# Altium project 电磁双车主控电路 第一版.PRJPCB
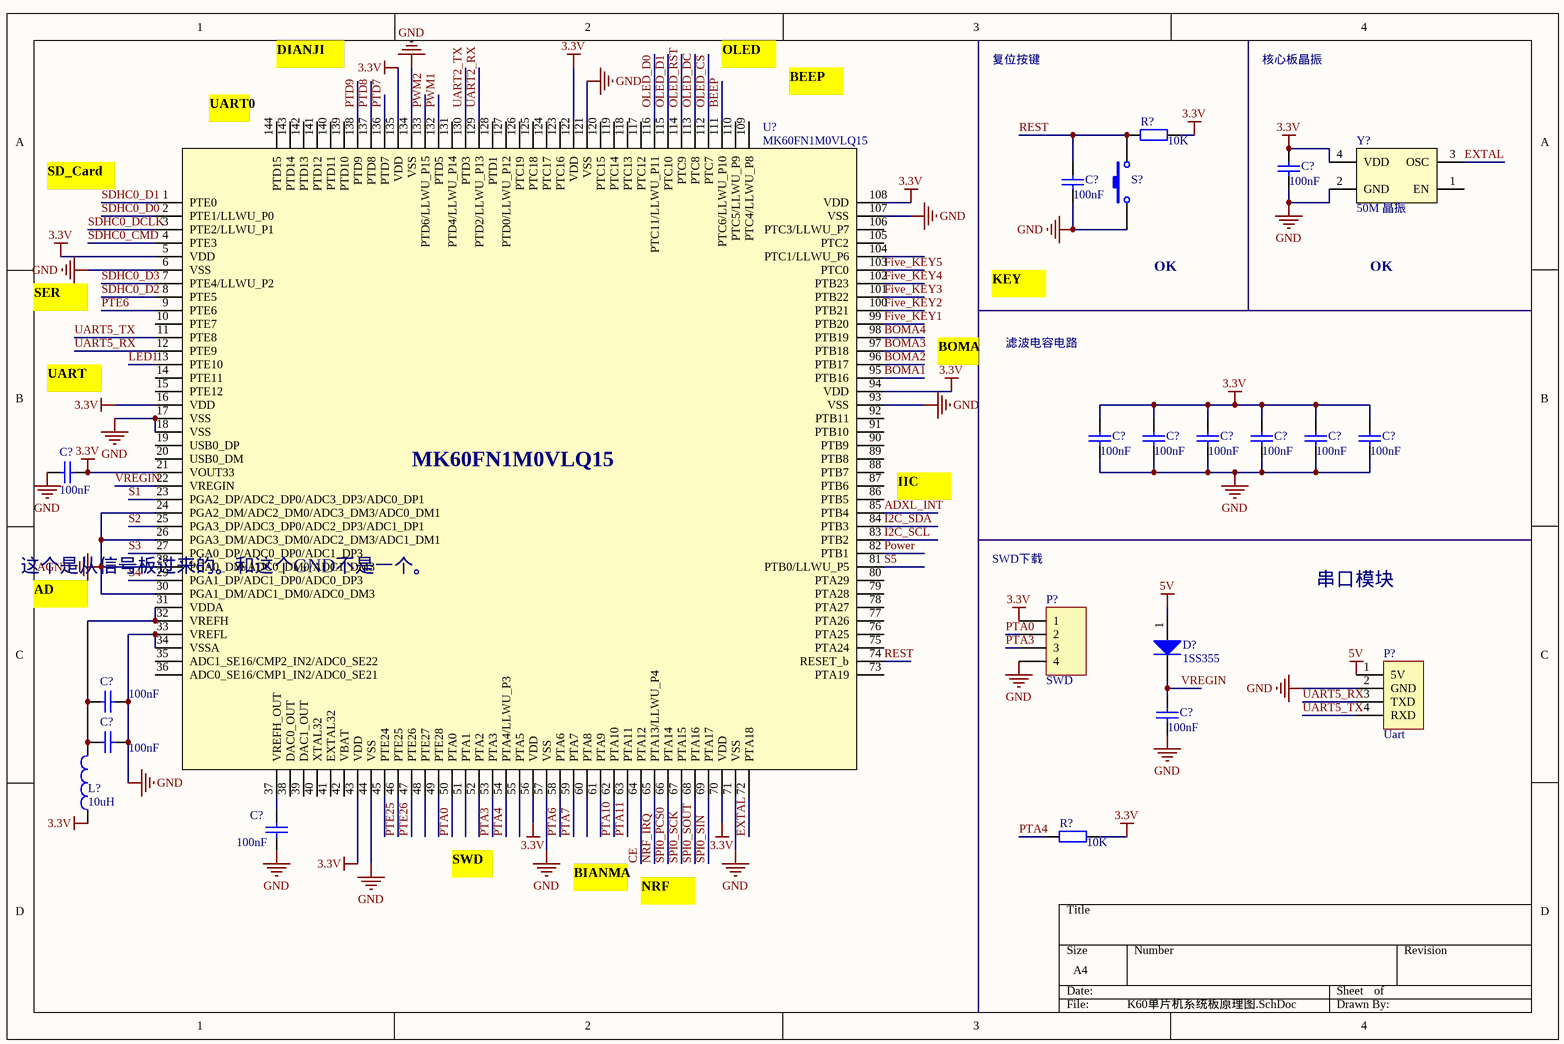
[diagram p0: K60单片机系统板原理图.SchDoc]
4 sheets, 112 parts. Net scope: global (net labels, ports and power ports of the same name join across sheets).
Board file: PCB1.PcbDoc
Sheets:
  K60单片机系统板原理图.SchDoc
  元器件模块原理图.SchDoc
  电机驱动原理图.SchDoc
  电源模块原理图.SchDoc

## Sheet K60单片机系统板原理图.SchDoc
size A4

### Parts
(Parts that share a designator on the sheet are numbered #1, #2 ... from top to bottom, then left to right.)
C?#1  value 100nF  [C0603]  (hidden comment: Cap)
C?#2  value 100nF  [C0603]  (hidden comment: Cap)
C?#3  value 100nF  [C0603]  (hidden comment: Cap)
C?#4  value 100nF  [C0603]  (hidden comment: Cap)
C?#5  value 100nF  [C0603]  (hidden comment: Cap)
C?#6  value 100nF  [C0603]  (hidden comment: Cap)
C?#7  value 100nF  [C0603]  (hidden comment: Cap)
C?#8  value 100nF  [C0603]  (hidden comment: Cap)
C?#9  value 100nF  [C0603]  (hidden comment: Cap)
C?#10  value 100nF  [C0603]  (hidden comment: Cap)
C?#11  value 100nF  [C0603]  (hidden comment: Cap)
C?#12  value 100nF  [C0603]  (hidden comment: Cap)
C?#13  value 100nF  [C0603]  (hidden comment: Cap)
D?#1  1SS355  [二极管贴片]
L?#1  value 10uH  [R0603]  (hidden comment: Inductor)
P?#1  SWD  [HDR1X4]
P?#2  Uart  [HDR1X4]
R?#1  value 10K  [R0603]  (hidden comment: Res2)
R?#2  value 10K  [R0603]  (hidden comment: Res2)
S?#1  SW-PB  [KEY]  (value not drawn)
U?#1  MK60FN1M0VLQ15  [K60_QFP144]
Y?  50M 晶振  [50MHz_MiNi]

### Nets
3.3V: C?#1.1 C?#3.1 C?#4.1 C?#5.1 C?#6.1 C?#7.1 C?#8.1 C?#9.2 L?#1.1 P?#1.1 R?#1.2 R?#2.2 U?#1.5(VDD) U?#1.16(VDD) U?#1.21(VOUT33) U?#1.43(VDD) U?#1.56(VDD) U?#1.70(VDD) U?#1.94(VDD) U?#1.108(VDD) U?#1.122(VDD) U?#1.135(VDD) Y?.4(VDD)
5V: D?#1.1(A) P?#2.1(5V)
AGND: U?#1.24(PGA2_DM/ADC2_DM0/ADC3_DM3/ADC0_DM1) U?#1.26(PGA3_DM/ADC3_DM0/ADC2_DM3/ADC1_DM1) U?#1.28(PGA0_DM/ADC0_DM0/ADC1_DM3) U?#1.30(PGA1_DM/ADC1_DM0/ADC0_DM3)
GND: C?#1.2 C?#2.2 C?#3.2 C?#4.2 C?#5.2 C?#6.2 C?#7.2 C?#8.2 C?#9.1 C?#10.2 C?#11.1 C?#12.2 C?#13.2 P?#1.4 P?#2.2(GND) S?#1.1 U?#1.6(VSS) U?#1.17(VSS) U?#1.18(VSS) U?#1.33(VREFL) U?#1.34(VSSA) U?#1.44(VSS) U?#1.57(VSS) U?#1.71(VSS) U?#1.93(VSS) U?#1.107(VSS) U?#1.121(VSS) U?#1.134(VSS) Y?.2(GND)
ADXL_INT: U?#1.85(PTB4)
BEEP: U?#1.111(PTC6/LLWU_P10)
BOMA1: U?#1.95(PTB16)
BOMA2: U?#1.96(PTB17)
BOMA3: U?#1.97(PTB18)
BOMA4: U?#1.98(PTB19)
CE: U?#1.64(PTA12)
EXTAL: U?#1.72(PTA18) Y?.3(OSC)
Five_KEY1: U?#1.99(PTB20)
Five_KEY2: U?#1.100(PTB21)
Five_KEY3: U?#1.101(PTB22)
Five_KEY4: U?#1.102(PTB23)
Five_KEY5: U?#1.103(PTC0)
I2C_SCL: U?#1.83(PTB2)
I2C_SDA: U?#1.84(PTB3)
LED1: U?#1.13(PTE10)
NRF_IRQ: U?#1.65(PTA13/LLWU_P4)
OLED_CS: U?#1.112(PTC7)
OLED_D0: U?#1.116(PTC11/LLWU_P11)
OLED_D1: U?#1.115(PTC10)
OLED_DC: U?#1.113(PTC8)
OLED_RST: U?#1.114(PTC9)
Power: U?#1.82(PTB1)
PTA0: P?#1.2 U?#1.50(PTA0)
PTA3: P?#1.3 U?#1.53(PTA3)
PTA4: R?#2.1 U?#1.54(PTA4/LLWU_P3)
PTA6: U?#1.58(PTA6)
PTA7: U?#1.59(PTA7)
PTA10: U?#1.62(PTA10)
PTA11: U?#1.63(PTA11)
PTD7: U?#1.136(PTD7)
PTD8: U?#1.137(PTD8)
PTD9: U?#1.138(PTD9)
PTE6: U?#1.9(PTE6)
PTE25: U?#1.46(PTE25)
PTE26: U?#1.47(PTE26)
PWM1: U?#1.132(PTD5)
PWM2: U?#1.133(PTD6/LLWU_P15)
REST: C?#2.1 R?#1.1 S?#1.2 U?#1.74(RESET_b)
S1: U?#1.23(PGA2_DP/ADC2_DP0/ADC3_DP3/ADC0_DP1)
S2: U?#1.25(PGA3_DP/ADC3_DP0/ADC2_DP3/ADC1_DP1)
S3: U?#1.27(PGA0_DP/ADC0_DP0/ADC1_DP3)
S4: U?#1.29(PGA1_DP/ADC1_DP0/ADC0_DP3)
S5: U?#1.81(PTB0/LLWU_P5)
SDHC0_CMD: U?#1.4(PTE3)
SDHC0_D0: U?#1.2(PTE1/LLWU_P0)
SDHC0_D1: U?#1.1(PTE0)
SDHC0_D2: U?#1.8(PTE5)
SDHC0_D3: U?#1.7(PTE4/LLWU_P2)
SDHC0_DCLK: U?#1.3(PTE2/LLWU_P1)
SPI0_PCS0: U?#1.66(PTA14)
SPI0_SCK: U?#1.67(PTA15)
SPI0_SIN: U?#1.69(PTA17)
SPI0_SOUT: U?#1.68(PTA16)
UART2_RX: U?#1.129(PTD2/LLWU_P13)
UART2_TX: U?#1.130(PTD3)
UART5_RX: P?#2.3(TXD) U?#1.12(PTE9)
UART5_TX: P?#2.4(RXD) U?#1.11(PTE8)
VREGIN: C?#11.2 D?#1.2(K) U?#1.22(VREGIN)
NetC?#10_1: C?#10.1 C?#12.1 L?#1.2 U?#1.31(VDDA) U?#1.32(VREFH)
NetC?#13_1: C?#13.1 U?#1.37(VREFH_OUT)

Not connected (* = marked no-connect by the designer): U?#1 10(PTE7) 14(PTE11) 15(PTE12) 19(USB0_DP) 20(USB0_DM) 35(ADC1_SE16/CMP2_IN2/ADC0_SE22) 36(ADC0_SE16/CMP1_IN2/ADC0_SE21) 38(DAC0_OUT) 39(DAC1_OUT) 40(XTAL32) 41(EXTAL32) 42(VBAT) 45(PTE24) 48(PTE27) 49(PTE28) 51(PTA1) 52(PTA2) 55(PTA5) 60(PTA8) 61(PTA9) 73(PTA19) 75(PTA24) 76(PTA25) 77(PTA26) 78(PTA27) 79(PTA28) 80(PTA29) 86(PTB5) 87(PTB6) 88(PTB7) 89(PTB8) 90(PTB9) 91(PTB10) 92(PTB11) 104(PTC1/LLWU_P6) 105(PTC2) 106(PTC3/LLWU_P7) 109(PTC4/LLWU_P8) 110(PTC5/LLWU_P9) 117(PTC12) 118(PTC13) 119(PTC14) 120(PTC15) 123(PTC16) 124(PTC17) 125(PTC18) 126(PTC19) 127(PTD0/LLWU_P12) 128(PTD1) 131(PTD4/LLWU_P14) 139(PTD10) 140(PTD11) 141(PTD12) 142(PTD13) 143(PTD14) 144(PTD15); Y? 1(EN)

### Notes on the sheet
- (near U?#1) UART0
- DIANJI
- OLED
- BEEP
- 复位按键
- 核心板晶振
- SD_Card
- OK
- SER
- KEY
- UART
- BOMA
- 滤波电容电路
- (near U?#1) IIC
- (near U?#1) 这个是从信号板过来的。和这个GND不是一个。
- SWD下载
- 串口模块
- AD
- SWD
- BIANMA
- NRF

### Library data of the parts
C?#1-C?#13 = Cap: Capacitor; Published: 8-Jun-2000; LatestRevisionDate: 17-Jul-2002; LatestRevisionNote: Re-released for DXP Platform.; PackageReference: RAD-0.3; Publisher: Altium Limited
  C?#11: PackageDescription: Radial Cap, Thru-Hole; 2 Leads; 0.3 in Pin Spacing
D?#1 = Diode 1N4002: 1 Amp General Purpose Rectifier; Published: 8-Jun-2000; LatestRevisionDate: 17-Jul-2002; LatestRevisionNote: Re-released for DXP Platform.; DatasheetVersion: 1998; PackageVersion: Aug-1999; PackageReference: DO-41; Publisher: Altium Limited; PackageDescription: Diode, Axial; Body 5.2 x 2.7 mm (LxDia. max), Lead Dia. 0.86 mm (max); Code_JEDEC: DO-204-AL; ComponentLink1Description: Manufacturer Link; ComponentLink1URL: http://www.fairchildsemi.com/; ComponentLink2Description: Datasheet; ComponentLink2URL: http://www.fairchildsemi.com/ds/1N%2F1N4001.pdf
L?#1 = Inductor: Code_IEC: 1005; Published: 8-Jun-2000; LatestRevisionDate: 17-Jul-2002; LatestRevisionNote: Re-released for DXP Platform.; PackageReference: 0402-A; Publisher: Altium Limited; Code_JEITA: 0402
P?#1 P?#2 = Header 4: Header, 4-Pin; LatestRevisionDate: 17-Jul-2002; LatestRevisionNote: Re-released for DXP Platform.; Publisher: Altium Limited
R?#1 R?#2 = Res2: Resistor; Published: 8-Jun-2000; LatestRevisionDate: 17-Jul-2002; LatestRevisionNote: Re-released for DXP Platform.; PackageReference: AXIAL-0.4; Publisher: Altium Limited
S?#1 = SW-PB: Switch; Published: 24-Mar-1999; LatestRevisionDate: 17-Jul-2002; LatestRevisionNote: Re-released for DXP Platform.; PackageReference: SPST-2; Publisher: Altium Limited

## Sheet 元器件模块原理图.SchDoc
size A4
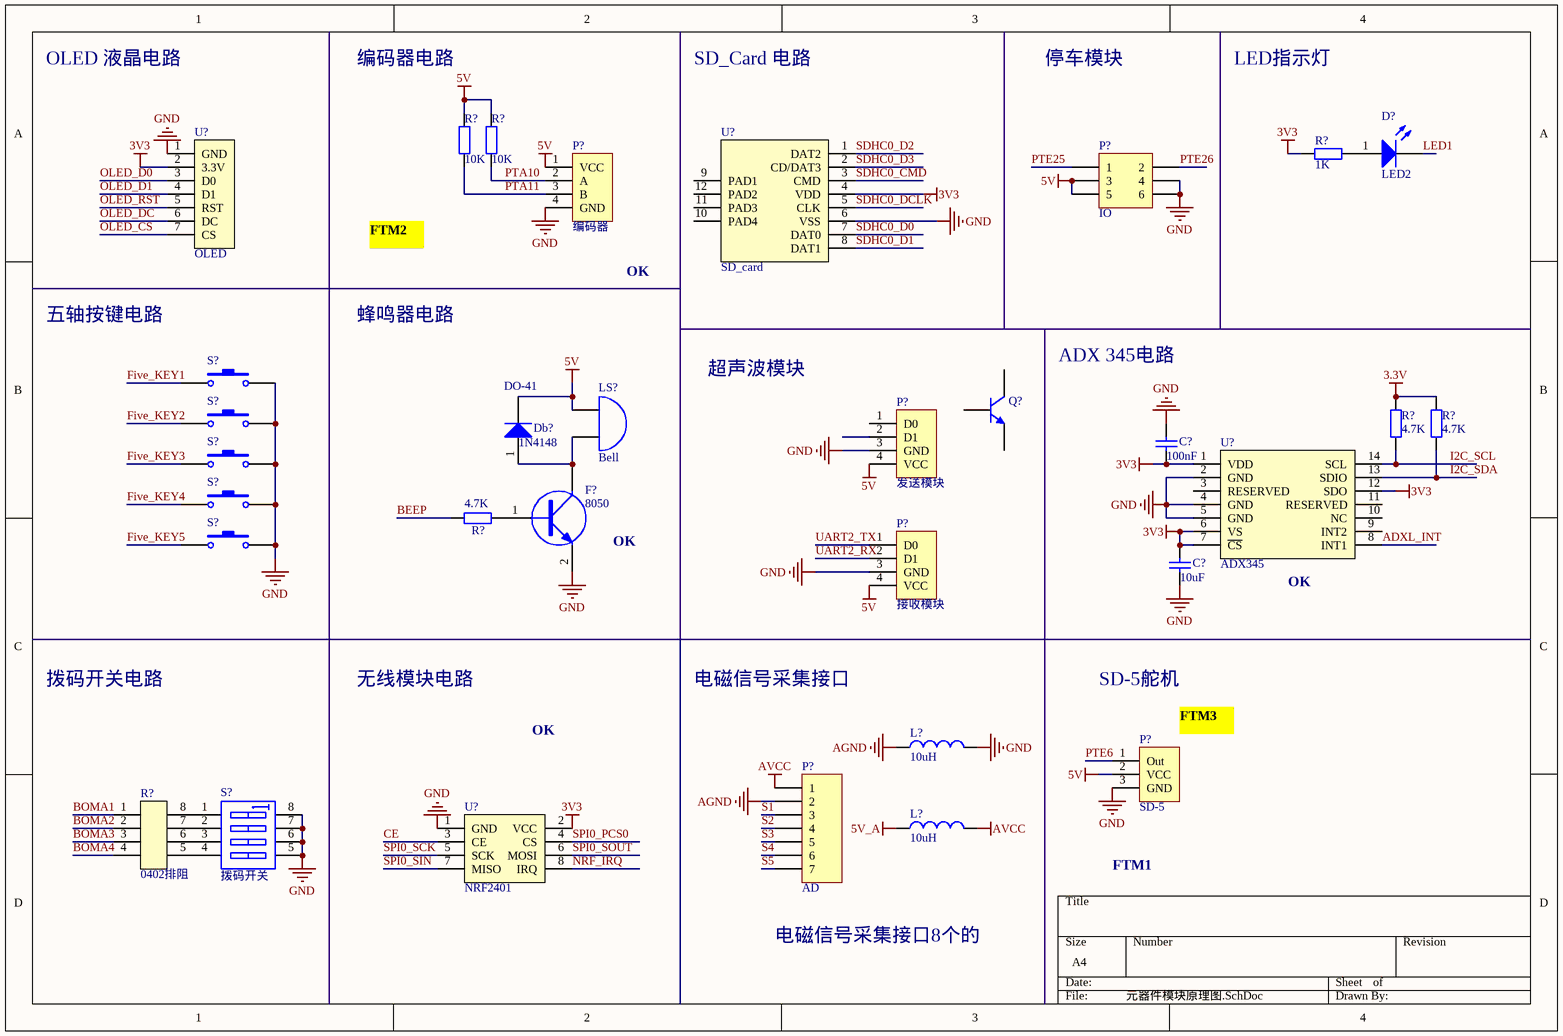
[diagram p1: 元器件模块原理图.SchDoc]

### Parts
(Parts that share a designator on the sheet are numbered #1, #2 ... from top to bottom, then left to right.)
C?#14  value 100nF  [C0603]  (hidden comment: Cap)
C?#15  value 10uF  [C0603]  (hidden comment: Cap)
D?#2  LED2  [LED-0805 - duplicate]
Db?  1N4148  PackageReference: DO-41  [二极管贴片]
F?#1  8050  [8050 贴片三极管]
L?#2  value 10uH  [R0603]  (hidden comment: Inductor)
L?#3  value 10uH  [R0603]  (hidden comment: Inductor)
LS?  Bell  [蜂鸣器]
P?#3  编码器  [HDR1X4]
P?#4  IO  [HDR2X3]
P?#5  发送模块  [HDR1X4]
P?#6  接收模块  [HDR1X4]
P?#7  SD-5  [HDR1X3]
P?#8  AD  [HDR1X7]
Q?#1  2N3904  [TO-92A]  (value not drawn)
R?#3  value 10K  [R0603]  (hidden comment: Res2)
R?#4  value 10K  [R0603]  (hidden comment: Res2)
R?#5  value 1K  [R0603]  (hidden comment: Res2)
R?#6  4.7K  [R0603]
R?#7  4.7K  [R0603]
R?#8  4.7K  [R0603]
R?#9  0402排阻  [0402_2]
S?#2  SW-PB  [KEY]  (value not drawn)
S?#3  SW-PB  [KEY]  (value not drawn)
S?#4  SW-PB  [KEY]  (value not drawn)
S?#5  SW-PB  [KEY]  (value not drawn)
S?#6  SW-PB  [KEY]  (value not drawn)
S?#7  拨码开关  [拨码开关]
U?#2  OLED  [HDR1X7]
U?#3  SD_card  [SD_Card]
U?#4  ADX345
U?#5  NRF2401  [HDR2X4]

### Nets
3.3V: R?#6.2 R?#7.2
3V3: C?#14.2 C?#15.1 R?#5.2 U?#2.2(3.3V) U?#3.4(VDD) U?#4.1(VDD) U?#4.6(VS) U?#4.7(~{CS}) U?#4.12(SDO) U?#5.2(VCC)
5V: Db?.2(K) LS?.1(A) P?#3.1(VCC) P?#4.3 P?#4.5 P?#5.4(VCC) P?#6.4(VCC) P?#7.2(VCC) R?#3.2 R?#4.2
5V_A: L?#3.1
AGND: L?#2.1 P?#8.2
AVCC: L?#3.2 P?#8.1
GND: C?#14.1 C?#15.2 F?#1.2(E) L?#2.2 P?#3.4(GND) P?#4.4 P?#4.6 P?#5.3(GND) P?#6.3(GND) P?#7.3(GND) S?#2.2 S?#3.2 S?#4.2 S?#5.2 S?#6.2 S?#7.5(B4) S?#7.6(B3) S?#7.7(B2) S?#7.8(B1) U?#2.1(GND) U?#3.6(VSS) U?#4.2(GND) U?#4.4(GND) U?#4.5(GND) U?#5.1(GND)
ADXL_INT: U?#4.8(INT1)
BEEP: R?#8.1
BOMA1: R?#9.1
BOMA2: R?#9.2
BOMA3: R?#9.3
BOMA4: R?#9.4
CE: U?#5.3(CE)
Five_KEY1: S?#2.1
Five_KEY2: S?#3.1
Five_KEY3: S?#4.1
Five_KEY4: S?#5.1
Five_KEY5: S?#6.1
I2C_SCL: R?#6.1 U?#4.14(SCL)
I2C_SDA: R?#7.1 U?#4.13(SDIO)
LED1: D?#2.2(K)
NRF_IRQ: U?#5.8(IRQ)
OLED_CS: U?#2.7(CS)
OLED_D0: U?#2.3(D0)
OLED_D1: U?#2.4(D1)
OLED_DC: U?#2.6(DC)
OLED_RST: U?#2.5(RST)
PTA10: P?#3.2(A) R?#4.1
PTA11: P?#3.3(B) R?#3.1
PTE6: P?#7.1(Out)
PTE25: P?#4.1
PTE26: P?#4.2
S1: P?#8.3
S2: P?#8.4
S3: P?#8.5
S4: P?#8.6
S5: P?#8.7
SDHC0_CMD: U?#3.3(CMD)
SDHC0_D0: U?#3.7(DAT0)
SDHC0_D1: U?#3.8(DAT1)
SDHC0_D2: U?#3.1(DAT2)
SDHC0_D3: U?#3.2(CD/DAT3)
SDHC0_DCLK: U?#3.5(CLK)
SPI0_PCS0: U?#5.4(CS)
SPI0_SCK: U?#5.5(SCK)
SPI0_SIN: U?#5.7(MISO)
SPI0_SOUT: U?#5.6(MOSI)
UART2_RX: P?#6.2(D1)
UART2_TX: P?#6.1(D0)
NetD?#2_1: D?#2.1(A) R?#5.1
NetDb?_1: Db?.1(A) F?#1.3(C) LS?.2(B)
NetF?#1_1: F?#1.1(B) R?#8.2
NetR?#9_5: R?#9.5 S?#7.4(A4)
NetR?#9_6: R?#9.6 S?#7.3(A3)
NetR?#9_7: R?#9.7 S?#7.2(A2)
NetR?#9_8: R?#9.8 S?#7.1(A1)

Not connected (* = marked no-connect by the designer): P?#5 1(D0) 2(D1); Q?#1 1(E) 2(B) 3(C); U?#3 9(PAD1) 10(PAD4) 11(PAD3) 12(PAD2); U?#4 3(RESERVED) 9(INT2) 10(NC) 11(RESERVED)

### Notes on the sheet
- OLED 液晶电路
- 编码器电路
- SD_Card 电路
- 停车模块
- LED指示灯
- FTM2
- 五轴按键电路
- 蜂鸣器电路
- OK
- 超声波模块
- ADX 345电路
- (near F?#1) OK
- (near U?#4) OK
- 拨码开关电路
- 无线模块电路
- 电磁信号采集接口
- SD-5舵机
- (near P?#7) FTM3
- FTM1
- 电磁信号采集接口8个的

### Library data of the parts
C?#14 C?#15 = Cap: Capacitor; Published: 8-Jun-2000; LatestRevisionDate: 17-Jul-2002; LatestRevisionNote: Re-released for DXP Platform.; PackageReference: RAD-0.3; Publisher: Altium Limited
D?#2 = LED2: Typical RED, GREEN, YELLOW, AMBER GaAs LED; Published: 8-Jun-2000; LatestRevisionDate: 17-Jul-2002; LatestRevisionNote: Re-released for DXP Platform.; PackageDocument: Feb-2002; PackageReference: 3.2X1.6X1.1; Publisher: Altium Limited
Db? = Diode 1N4001: 1 Amp General Purpose Rectifier; Published: 8-Jun-2000; LatestRevisionDate: 17-Jul-2002; LatestRevisionNote: Re-released for DXP Platform.; DatasheetVersion: 1998; PackageVersion: Aug-1999; Publisher: Altium Limited; PackageDescription: Diode, Axial; Body 5.2 x 2.7 mm (LxDia. max), Lead Dia. 0.86 mm (max); Code_JEDEC: DO-204-AL; ComponentLink1Description: Manufacturer Link; ComponentLink1URL: http://www.fairchildsemi.com/; ComponentLink2Description: Datasheet; ComponentLink2URL: http://www.fairchildsemi.com/ds/1N%2F1N4001.pdf
F?#1 = NPN: NPN Transistor
L?#2 L?#3 = Inductor: Code_IEC: 1005; Published: 8-Jun-2000; LatestRevisionDate: 17-Jul-2002; LatestRevisionNote: Re-released for DXP Platform.; PackageReference: 0402-A; Publisher: Altium Limited; Code_JEITA: 0402
LS? = Bell: Electrical Bell; Published: 24-Mar-1999; LatestRevisionDate: 17-Jul-2002; LatestRevisionNote: Re-released for DXP Platform.; PackageReference: PIN2; Publisher: Altium Limited
P?#3 P?#5 P?#6 = Header 4: Header, 4-Pin; LatestRevisionDate: 17-Jul-2002; LatestRevisionNote: Re-released for DXP Platform.; Publisher: Altium Limited
P?#4 = Header 3X2: Header, 3-Pin, Dual row; LatestRevisionDate: 17-Jul-2002; LatestRevisionNote: Re-released for DXP Platform.; Publisher: Altium Limited
P?#7 = Header 3: Header, 3-Pin; LatestRevisionDate: 17-Jul-2002; LatestRevisionNote: Re-released for DXP Platform.; Publisher: Altium Limited
P?#8 = Header 7: Header, 7-Pin; LatestRevisionDate: 17-Jul-2002; LatestRevisionNote: Re-released for DXP Platform.; Publisher: Altium Limited
Q?#1 = 2N3904: NPN General Purpose Amplifier; Published: 8-Jun-2000; LatestRevisionDate: 15-Jan-2003; LatestRevisionNote: PCB Footprint 'BCY-W3/D4.7' replaced; DatasheetVersion: 1997; PackageVersion: Sep-1998; PackageReference: TO-92A; Publisher: Altium Limited; PackageDescription: TO, Flat Index; 3 In-Line, Axial Leads; Body Dia. 4.5mm; Leads 0.51 x 0.48 mm (max); ComponentLink1Description: Manufacturer Link; ComponentLink1URL: http://www.fairchildsemi.com/; ComponentLink2Description: Datasheet; ComponentLink2URL: http://www.fairchildsemi.com/ds/2N%2F2N3904.pdf
R?#3-R?#8 = Res2: Resistor; Published: 8-Jun-2000; LatestRevisionDate: 17-Jul-2002; LatestRevisionNote: Re-released for DXP Platform.; PackageReference: AXIAL-0.4; Publisher: Altium Limited
  R?#6-R?#8: PackageDescription: Axial Device, Thru-Hole; 2 Leads; 0.4 in Pin Spacing; Value: 4.7K
S?#2-S?#6 = SW-PB: Switch; Published: 24-Mar-1999; LatestRevisionDate: 17-Jul-2002; LatestRevisionNote: Re-released for DXP Platform.; PackageReference: SPST-2; Publisher: Altium Limited
S?#7 = SW DIP-4: DIP Switch, 4 Position, SPST; Published: 24-Mar-1999; LatestRevisionDate: 17-Jul-2002; LatestRevisionNote: Re-released for DXP Platform.; PackageReference: SO8; Publisher: Altium Limited; Code_JEDEC: MS-012-AA; Code_IPC: SO8

## Sheet 电机驱动原理图.SchDoc
size A4
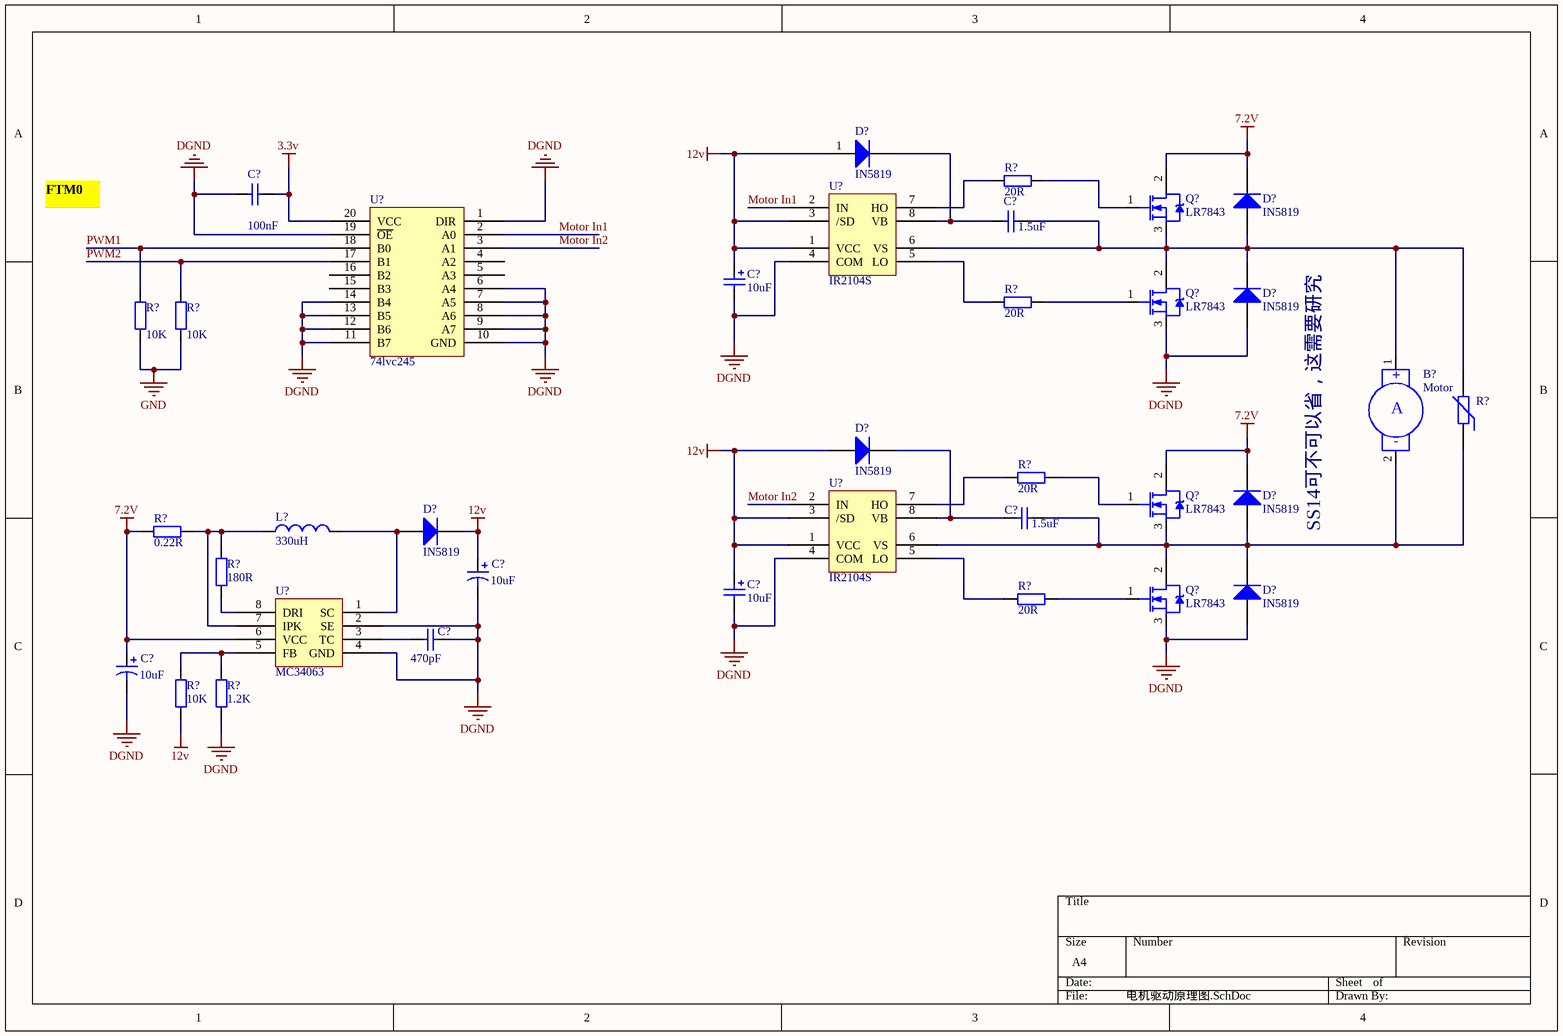
[diagram p2: 电机驱动原理图.SchDoc]

### Parts
(Parts that share a designator on the sheet are numbered #1, #2 ... from top to bottom, then left to right.)
B?  Motor  [7.2V]
C?#16  value 100nF  [C0603]  (hidden comment: Cap)
C?#17  value 1.5uF  [C0603]  (hidden comment: Cap Semi)
C?#18  value 10uF  [C0603]  (hidden comment: Cap Pol1)
C?#19  value 1.5uF  [C0603]  (hidden comment: Cap Semi)
C?#20  value 10uF  [钽电容]  (hidden comment: Cap Pol1)
C?#21  value 10uF  [C0603]  (hidden comment: Cap Pol1)
C?#22  value 470pF  [C0603]  (hidden comment: Cap Semi)
C?#23  value 10uF  [钽电容]  (hidden comment: Cap Pol1)
D?#3  IN5819  [二极管贴片]
D?#4  IN5819  [二极管贴片]
D?#5  IN5819  [二极管贴片]
D?#6  IN5819  [二极管贴片]
D?#7  IN5819  [二极管贴片]
D?#8  IN5819  [二极管贴片]
D?#9  IN5819  [二极管贴片]
L?#4  value 330uH  [221贴片电感]  (hidden comment: Inductor)
Q?#2  LR7843  [LR7843]
Q?#3  LR7843  [LR7843]
Q?#4  LR7843  [LR7843]
Q?#5  LR7843  [LR7843]
R?#10  value 20R  [R0603]  (hidden comment: Res2)
R?#11  value 20R  [R0603]  (hidden comment: Res2)
R?#12  value 10K  [R0603]  (hidden comment: Res2)
R?#13  value 10K  [C0603]  (hidden comment: Res2)
R?#14  Res Varistor  [R0603]  (value not drawn)
R?#15  value 20R  [R0603]  (hidden comment: Res2)
R?#16  value 0.22R  [R0603]  (hidden comment: Res2)
R?#17  value 180R  [R0603]  (hidden comment: Res2)
R?#18  value 20R  [R0603]  (hidden comment: Res2)
R?#19  value 10K  [R0603]  (hidden comment: Res2)
R?#20  value 1.2K  [R0603]  (hidden comment: Res2)
U?#6  74lvc245  [74LVC245 TSSOP]
U?#7  IR2104S  [IR2104]
U?#8  IR2104S  [IR2104]
U?#9  MC34063  [MC34063]

### Nets
3.3V: C?#16.2 U?#6.20(VCC)
7.2V: C?#23.1 D?#4.2(K) D?#7.2(K) Q?#2.2(D) Q?#4.2(D) R?#16.1 U?#9.6(VCC)
12v: C?#18.1 C?#20.1 C?#21.1 D?#3.1(A) D?#6.1(A) D?#8.2(K) R?#19.2 U?#7.1(VCC) U?#7.3(/SD) U?#8.1(VCC) U?#8.3(/SD)
DGND: C?#16.1 C?#18.2 C?#20.2 C?#21.2 C?#22.2 C?#23.2 D?#5.1(A) D?#9.1(A) Q?#3.3(S) Q?#5.3(S) R?#20.1 U?#6.1(DIR) U?#6.6(A4) U?#6.7(A5) U?#6.8(A6) U?#6.9(A7) U?#6.10(GND) U?#6.11(B7) U?#6.12(B6) U?#6.13(B5) U?#6.14(B4) U?#6.19(~{OE}) U?#7.4(COM) U?#8.4(COM) U?#9.2(SE) U?#9.4(GND)
GND: R?#12.1 R?#13.1
Motor In1: U?#6.2(A0) U?#7.2(IN)
Motor In2: U?#6.3(A1) U?#8.2(IN)
PWM1: R?#12.2 U?#6.18(B0)
PWM2: R?#13.2 U?#6.17(B1)
NetB?_1: B?.1(+) C?#17.2 D?#4.1(A) D?#5.2(K) Q?#2.3(S) Q?#3.2(D) R?#14.2 U?#7.6(VS)
NetB?_2: B?.2(-) C?#19.2 D?#7.1(A) D?#9.2(K) Q?#4.3(S) Q?#5.2(D) R?#14.1 U?#8.6(VS)
NetC?#17_1: C?#17.1 D?#3.2(K) U?#7.8(VB)
NetC?#19_1: C?#19.1 D?#6.2(K) U?#8.8(VB)
NetC?#22_1: C?#22.1 U?#9.3(TC)
NetD?#8_1: D?#8.1(A) L?#4.2 U?#9.1(SC)
NetL?#4_1: L?#4.1 R?#16.2 R?#17.2 U?#9.7(IPK)
NetQ?#2_1: Q?#2.1(G) R?#10.2
NetQ?#3_1: Q?#3.1(G) R?#11.2
NetQ?#4_1: Q?#4.1(G) R?#15.2
NetQ?#5_1: Q?#5.1(G) R?#18.2
NetR?#10_1: R?#10.1 U?#7.7(HO)
NetR?#11_1: R?#11.1 U?#7.5(LO)
NetR?#15_1: R?#15.1 U?#8.7(HO)
NetR?#17_1: R?#17.1 U?#9.8(DRI)
NetR?#18_1: R?#18.1 U?#8.5(LO)
NetR?#19_1: R?#19.1 R?#20.2 U?#9.5(FB)

Not connected (* = marked no-connect by the designer): U?#6 4(A2) 5(A3) 15(B3) 16(B2)

### Notes on the sheet
- FTM0
- SS14可不可以省，这需要研究
- (in symbol Motor Servo) A

### Library data of the parts
B? = Motor Servo: Servo Motor
C?#16 = Cap: Capacitor; Published: 8-Jun-2000; LatestRevisionDate: 17-Jul-2002; LatestRevisionNote: Re-released for DXP Platform.; PackageReference: RAD-0.3; Publisher: Altium Limited; PackageDescription: Radial Cap, Thru-Hole; 2 Leads; 0.3 in Pin Spacing
C?#17 C?#19 C?#22 = Cap Semi: Capacitor (Semiconductor SIM Model); Published: 8-Jun-2000; LatestRevisionDate: 29-May-2009; LatestRevisionNote: IPC-7351 Footprint Added.; PackageReference: C1206; Publisher: Altium Limited; PackageDescription: Chip Capacitor
C?#18 C?#20 C?#21 C?#23 = Cap Pol1: Polarized Capacitor (Radial); Published: 8-Jun-2000; LatestRevisionDate: 17-Jul-2002; LatestRevisionNote: Re-released for DXP Platform.; PackageReference: RB7.6-15; Publisher: Altium Limited
  C?#18 C?#21: PackageDescription: Polarized Capacitor (Radial); 2 Leads
D?#3-D?#9 = Diode: Default Diode; PackageVersion: Sep-1996; PackageDescription: DO-214-AB/SMC; 2 C-Bend Leads; Body 7.9 x 5.9 mm, inc. leads (LxW); Code_JEDEC: DO-214-AB
L?#4 = Inductor: Code_IEC: 1005; Published: 8-Jun-2000; LatestRevisionDate: 29-May-2009; LatestRevisionNote: IPC-7351 Footprint Added.; PackageReference: 0402-A; Publisher: Altium Limited; PackageDescription: Chip Inductor; Code_JEITA: 0402
Q?#2-Q?#5 = NMOS-2: N-Channel Power MOSFET; Note: Pin 2 is electrically connected to pin 4.; Published: 8-Jun-2000; LatestRevisionDate: 17-Jul-2002; LatestRevisionNote: Re-released for DXP Platform.; DatasheetVersion: PD-9.814; PackageVersion: Feb-1997; PackageReference: TO-220AB; Publisher: Altium Limited; PackageDescription: TO, Thru-Hole, Vertical, Heatsink Mounted; 3 In-Line Leads; Pitch 2.54 mm; ComponentLink1Description: Manufacturer Link; ComponentLink1URL: http://www.irf.com/
R?#10-R?#13 R?#15-R?#20 = Res2: Resistor; Published: 8-Jun-2000; LatestRevisionDate: 17-Jul-2002; LatestRevisionNote: Re-released for DXP Platform.; PackageReference: AXIAL-0.4; Publisher: Altium Limited; PackageDescription: Axial Device, Thru-Hole; 2 Leads; 0.4 in Pin Spacing
R?#14 = Res Varistor: Varistor (Voltage-Sensitive Resistor); Published: 24-Mar-1999; LatestRevisionDate: 04-Mar-2005; LatestRevisionNote: PCB Footprint replaced.; PackageReference: 6-0805; Publisher: Altium Limited
U?#6 = 74lvc245: 8位5伏转3.3伏电平转换芯片
U?#7 U?#8 = Component_1_1
U?#9 = MC34063: Header, 2-Pin

## Sheet 电源模块原理图.SchDoc
size A4
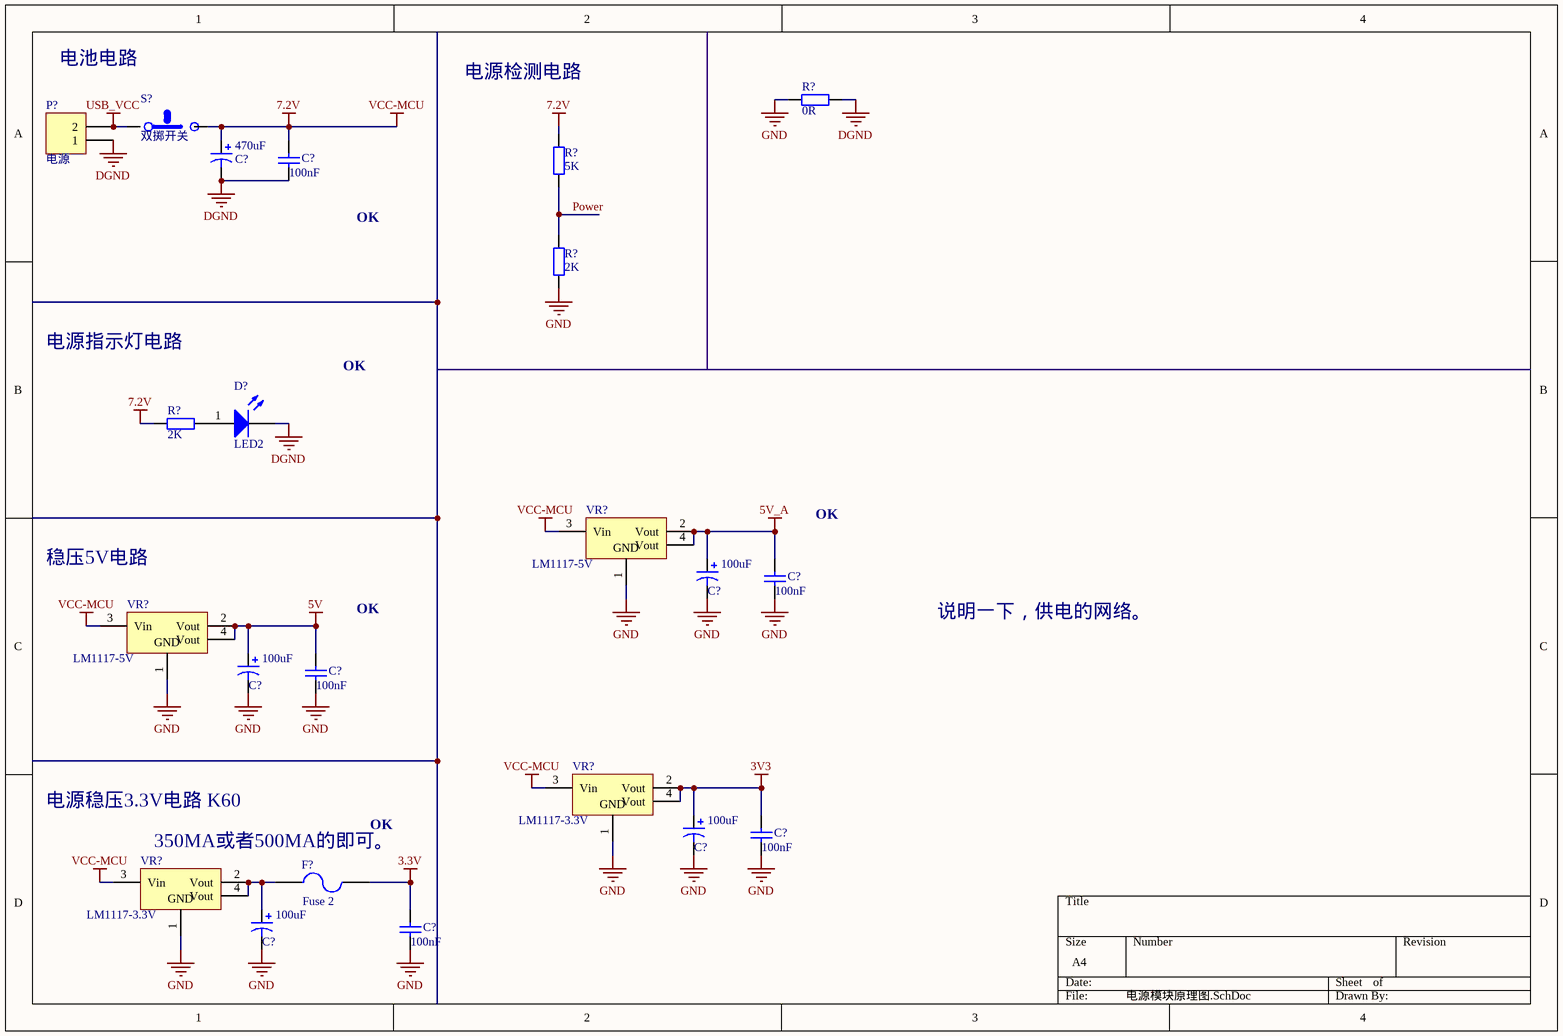
[diagram p3: 电源模块原理图.SchDoc]

### Parts
(Parts that share a designator on the sheet are numbered #1, #2 ... from top to bottom, then left to right.)
C?#24  470uF  [470uF]
C?#25  value 100nF  [C0603]  (hidden comment: Cap)
C?#26  100uF  [正负电容]
C?#27  value 100nF  [C0603]  (hidden comment: Cap)
C?#28  100uF  [正负电容]
C?#29  value 100nF  [C0603]  (hidden comment: Cap)
C?#30  100uF  [正负电容]
C?#31  value 100nF  [C0603]  (hidden comment: Cap)
C?#32  100uF  [正负电容]
C?#33  value 100nF  [C0603]  (hidden comment: Cap)
D?#10  LED2  [LED-0805 - duplicate]
F?#2  Fuse 2  [贴片保险丝]
P?#9  电源  [7.2V]
R?#21  value 0R  [R0603]  (hidden comment: Res2)
R?#22  value 5K  [R0603]  (hidden comment: Res2)
R?#23  value 2K  [R0603]  (hidden comment: Res2)
R?#24  value 2K  [R0603]  (hidden comment: Res2)
S?#8  双掷开关  [总开关]
VR?#1  LM1117-5V  [SOT223]
VR?#2  LM1117-5V  [SOT223]
VR?#3  LM1117-3.3V  [SOT223]
VR?#4  LM1117-3.3V  [SOT223]

### Nets
3.3V: C?#33.1 F?#2.2
3V3: C?#30.1 C?#31.1 VR?#3.2(Vout) VR?#3.4(Vout)
5V: C?#28.1 C?#29.1 VR?#2.2(Vout) VR?#2.4(Vout)
5V_A: C?#26.1 C?#27.1 VR?#1.2(Vout) VR?#1.4(Vout)
7.2V: C?#24.1 C?#25.1 R?#22.2 R?#24.2 S?#8.2 VR?#1.3(Vin) VR?#2.3(Vin) VR?#3.3(Vin) VR?#4.3(Vin)  [also labelled VCC-MCU]
DGND: C?#24.2 C?#25.2 D?#10.2(K) P?#9.1 R?#21.1
GND: C?#26.2 C?#27.2 C?#28.2 C?#29.2 C?#30.2 C?#31.2 C?#32.2 C?#33.2 R?#21.2 R?#23.1 VR?#1.1(GND) VR?#2.1(GND) VR?#3.1(GND) VR?#4.1(GND)
USB_VCC: P?#9.2 S?#8.1
Power: R?#22.1 R?#23.2
NetC?#32_1: C?#32.1 F?#2.1 VR?#4.2(Vout) VR?#4.4(Vout)
NetD?#10_1: D?#10.1(A) R?#24.1

### Notes on the sheet
- 电池电路
- 电源检测电路
- OK
- 电源指示灯电路
- 稳压5V电路
- 说明一下，供电的网络。
- 电源稳压3.3V电路 K60
- 350MA或者500MA的即可。

### Library data of the parts
C?#24 C?#26 C?#28 C?#30 C?#32 = Cap Pol1: Polarized Capacitor (Radial); Published: 8-Jun-2000; LatestRevisionDate: 17-Jul-2002; LatestRevisionNote: Re-released for DXP Platform.; PackageReference: RB7.6-15; Publisher: Altium Limited
C?#25 C?#27 C?#29 C?#31 C?#33 = Cap: Capacitor; Published: 8-Jun-2000; LatestRevisionDate: 17-Jul-2002; LatestRevisionNote: Re-released for DXP Platform.; PackageReference: RAD-0.3; Publisher: Altium Limited
D?#10 = LED2: as D?#2 on sheet 元器件模块原理图; Published: 8-Jun-2000; LatestRevisionDate: 17-Jul-2002; LatestRevisionNote: Re-released for DXP Platform.; PackageDocument: Feb-2002; PackageReference: 3.2X1.6X1.1; Publisher: Altium Limited
F?#2 = Fuse 2: Fuse; Published: 8-Jun-2000; LatestRevisionDate: 17-Jul-2002; LatestRevisionNote: Re-released for DXP Platform.; PackageReference: PIN-W2/E2.8; Publisher: Altium Limited
P?#9 = Header 2: Header, 2-Pin; LatestRevisionDate: 17-Jul-2002; LatestRevisionNote: Re-released for DXP Platform.; Publisher: Altium Limited
R?#21-R?#24 = Res2: Resistor; Published: 8-Jun-2000; LatestRevisionDate: 17-Jul-2002; LatestRevisionNote: Re-released for DXP Platform.; PackageReference: AXIAL-0.4; Publisher: Altium Limited
  R?#21-R?#23: PackageDescription: Axial Device, Thru-Hole; 2 Leads; 0.4 in Pin Spacing
VR?#1-VR?#4 = LM1117: Voltage Regulator; Published: 24-Mar-1999; LatestRevisionDate: 17-Jul-2002; LatestRevisionNote: Re-released for DXP Platform.; PackageReference: D2PAK; Publisher: Altium Limited; Code_JEDEC: SMD-220

## Nets that join several sheets
3.3V: K60单片机系统板原理图 (23 pins), 元器件模块原理图 (R?#6.2 R?#7.2), 电机驱动原理图 (C?#16.2 U?#6.20), 电源模块原理图 (C?#33.1 F?#2.2)
3V3: 元器件模块原理图 (10 pins), 电源模块原理图 (C?#30.1 C?#31.1 VR?#3.2 VR?#3.4)
5V: K60单片机系统板原理图 (D?#1.1 P?#2.1), 元器件模块原理图 (10 pins), 电源模块原理图 (C?#28.1 C?#29.1 VR?#2.2 VR?#2.4)
5V_A: 元器件模块原理图 (L?#3.1), 电源模块原理图 (C?#26.1 C?#27.1 VR?#1.2 VR?#1.4)
7.2V: 电机驱动原理图 (7 pins), 电源模块原理图 (9 pins)
AGND: K60单片机系统板原理图 (U?#1.24 U?#1.26 U?#1.28 U?#1.30), 元器件模块原理图 (L?#2.1 P?#8.2)
DGND: 电机驱动原理图 (26 pins), 电源模块原理图 (5 pins)
GND: K60单片机系统板原理图 (29 pins), 元器件模块原理图 (25 pins), 电机驱动原理图 (R?#12.1 R?#13.1), 电源模块原理图 (14 pins)
ADXL_INT: K60单片机系统板原理图 (U?#1.85), 元器件模块原理图 (U?#4.8)
BEEP: K60单片机系统板原理图 (U?#1.111), 元器件模块原理图 (R?#8.1)
BOMA1: K60单片机系统板原理图 (U?#1.95), 元器件模块原理图 (R?#9.1)
BOMA2: K60单片机系统板原理图 (U?#1.96), 元器件模块原理图 (R?#9.2)
BOMA3: K60单片机系统板原理图 (U?#1.97), 元器件模块原理图 (R?#9.3)
BOMA4: K60单片机系统板原理图 (U?#1.98), 元器件模块原理图 (R?#9.4)
CE: K60单片机系统板原理图 (U?#1.64), 元器件模块原理图 (U?#5.3)
Five_KEY1: K60单片机系统板原理图 (U?#1.99), 元器件模块原理图 (S?#2.1)
Five_KEY2: K60单片机系统板原理图 (U?#1.100), 元器件模块原理图 (S?#3.1)
Five_KEY3: K60单片机系统板原理图 (U?#1.101), 元器件模块原理图 (S?#4.1)
Five_KEY4: K60单片机系统板原理图 (U?#1.102), 元器件模块原理图 (S?#5.1)
Five_KEY5: K60单片机系统板原理图 (U?#1.103), 元器件模块原理图 (S?#6.1)
I2C_SCL: K60单片机系统板原理图 (U?#1.83), 元器件模块原理图 (R?#6.1 U?#4.14)
I2C_SDA: K60单片机系统板原理图 (U?#1.84), 元器件模块原理图 (R?#7.1 U?#4.13)
LED1: K60单片机系统板原理图 (U?#1.13), 元器件模块原理图 (D?#2.2)
NRF_IRQ: K60单片机系统板原理图 (U?#1.65), 元器件模块原理图 (U?#5.8)
OLED_CS: K60单片机系统板原理图 (U?#1.112), 元器件模块原理图 (U?#2.7)
OLED_D0: K60单片机系统板原理图 (U?#1.116), 元器件模块原理图 (U?#2.3)
OLED_D1: K60单片机系统板原理图 (U?#1.115), 元器件模块原理图 (U?#2.4)
OLED_DC: K60单片机系统板原理图 (U?#1.113), 元器件模块原理图 (U?#2.6)
OLED_RST: K60单片机系统板原理图 (U?#1.114), 元器件模块原理图 (U?#2.5)
Power: K60单片机系统板原理图 (U?#1.82), 电源模块原理图 (R?#22.1 R?#23.2)
PTA10: K60单片机系统板原理图 (U?#1.62), 元器件模块原理图 (P?#3.2 R?#4.1)
PTA11: K60单片机系统板原理图 (U?#1.63), 元器件模块原理图 (P?#3.3 R?#3.1)
PTE6: K60单片机系统板原理图 (U?#1.9), 元器件模块原理图 (P?#7.1)
PTE25: K60单片机系统板原理图 (U?#1.46), 元器件模块原理图 (P?#4.1)
PTE26: K60单片机系统板原理图 (U?#1.47), 元器件模块原理图 (P?#4.2)
PWM1: K60单片机系统板原理图 (U?#1.132), 电机驱动原理图 (R?#12.2 U?#6.18)
PWM2: K60单片机系统板原理图 (U?#1.133), 电机驱动原理图 (R?#13.2 U?#6.17)
S1: K60单片机系统板原理图 (U?#1.23), 元器件模块原理图 (P?#8.3)
S2: K60单片机系统板原理图 (U?#1.25), 元器件模块原理图 (P?#8.4)
S3: K60单片机系统板原理图 (U?#1.27), 元器件模块原理图 (P?#8.5)
S4: K60单片机系统板原理图 (U?#1.29), 元器件模块原理图 (P?#8.6)
S5: K60单片机系统板原理图 (U?#1.81), 元器件模块原理图 (P?#8.7)
SDHC0_CMD: K60单片机系统板原理图 (U?#1.4), 元器件模块原理图 (U?#3.3)
SDHC0_D0: K60单片机系统板原理图 (U?#1.2), 元器件模块原理图 (U?#3.7)
SDHC0_D1: K60单片机系统板原理图 (U?#1.1), 元器件模块原理图 (U?#3.8)
SDHC0_D2: K60单片机系统板原理图 (U?#1.8), 元器件模块原理图 (U?#3.1)
SDHC0_D3: K60单片机系统板原理图 (U?#1.7), 元器件模块原理图 (U?#3.2)
SDHC0_DCLK: K60单片机系统板原理图 (U?#1.3), 元器件模块原理图 (U?#3.5)
SPI0_PCS0: K60单片机系统板原理图 (U?#1.66), 元器件模块原理图 (U?#5.4)
SPI0_SCK: K60单片机系统板原理图 (U?#1.67), 元器件模块原理图 (U?#5.5)
SPI0_SIN: K60单片机系统板原理图 (U?#1.69), 元器件模块原理图 (U?#5.7)
SPI0_SOUT: K60单片机系统板原理图 (U?#1.68), 元器件模块原理图 (U?#5.6)
UART2_RX: K60单片机系统板原理图 (U?#1.129), 元器件模块原理图 (P?#6.2)
UART2_TX: K60单片机系统板原理图 (U?#1.130), 元器件模块原理图 (P?#6.1)